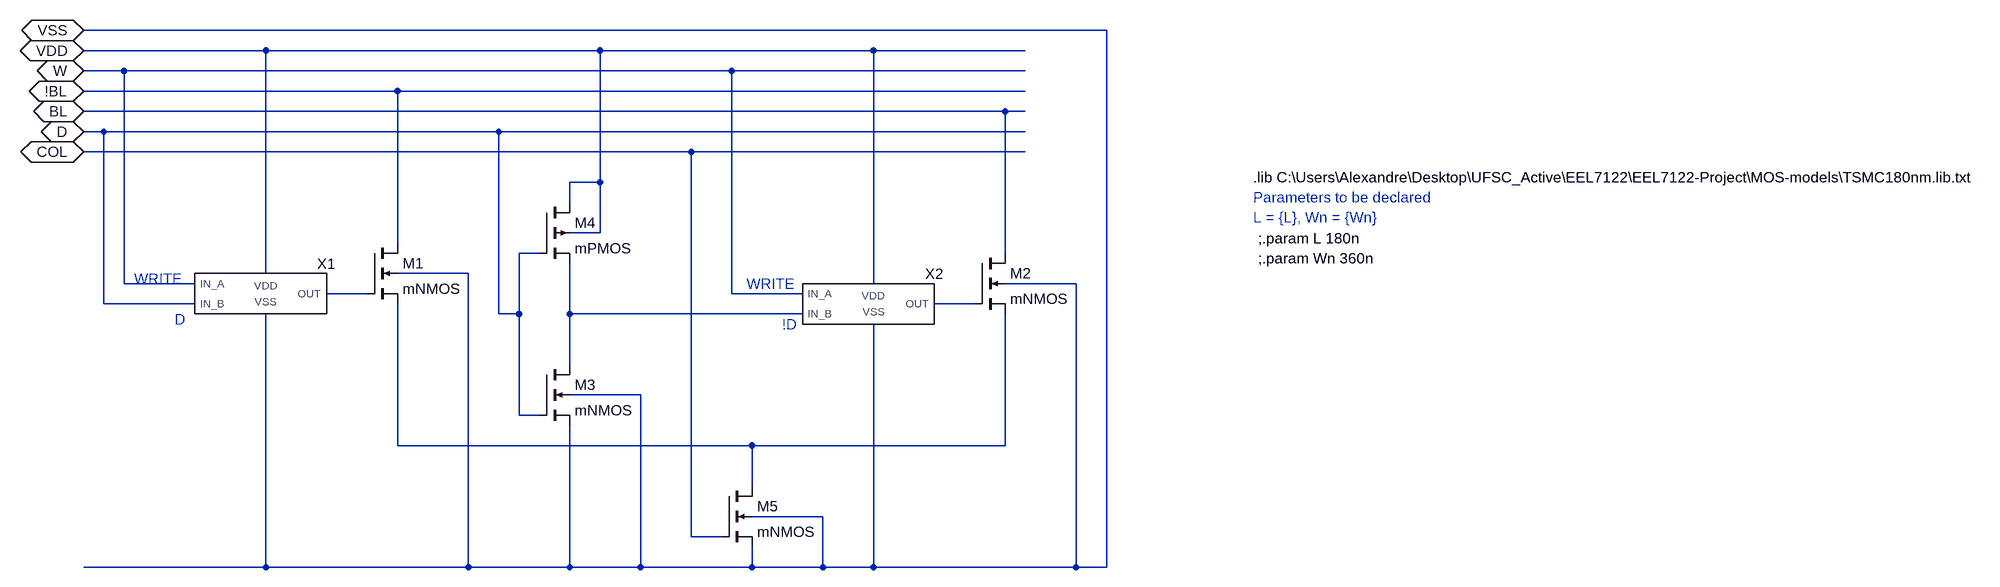
[diagram p0: schematic WRITE_DRIVER.asc]
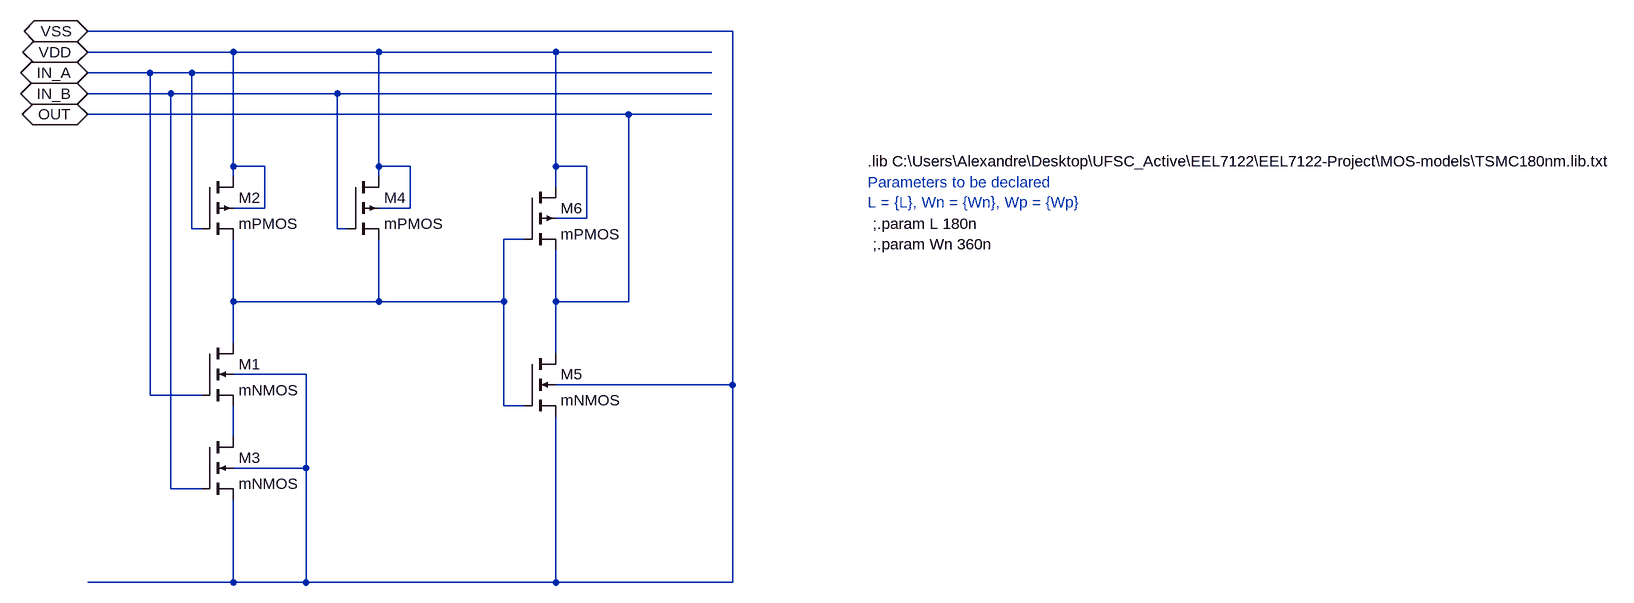
[diagram p1: sub-circuit and_sram.asc]
WRITE_DRIVER.asc, the LTspice schematic file:
Version 4
SHEET 1 2788 680
WIRE 1296 -368 -320 -368
WIRE -32 -336 -320 -336
WIRE 496 -336 -32 -336
WIRE 928 -336 496 -336
WIRE 1168 -336 928 -336
WIRE -256 -304 -320 -304
WIRE 704 -304 -256 -304
WIRE 1168 -304 704 -304
WIRE 176 -272 -320 -272
WIRE 1168 -272 176 -272
WIRE 1136 -240 -320 -240
WIRE 1168 -240 1136 -240
WIRE -288 -208 -320 -208
WIRE 336 -208 -288 -208
WIRE 1168 -208 336 -208
WIRE 640 -176 -320 -176
WIRE 1168 -176 640 -176
WIRE 496 -128 496 -336
WIRE 496 -128 448 -128
WIRE 448 -96 448 -128
WIRE 496 -48 496 -128
WIRE 496 -48 448 -48
WIRE 176 -32 176 -272
WIRE 400 -16 368 -16
WIRE 1136 -16 1136 -240
WIRE -32 16 -32 -336
WIRE 288 16 176 16
WIRE -256 32 -256 -304
WIRE -144 32 -256 32
WIRE 928 32 928 -336
WIRE 1248 32 1136 32
WIRE 128 48 64 48
WIRE 704 48 704 -304
WIRE 816 48 704 48
WIRE -288 64 -288 -208
WIRE -144 64 -288 64
WIRE 1088 64 1024 64
WIRE 336 80 336 -208
WIRE 368 80 368 -16
WIRE 368 80 336 80
WIRE 448 80 448 0
WIRE 816 80 448 80
WIRE 448 160 448 80
WIRE 560 208 448 208
WIRE 368 240 368 80
WIRE 400 240 368 240
WIRE 176 288 176 64
WIRE 736 288 176 288
WIRE 1136 288 1136 80
WIRE 1136 288 736 288
WIRE 736 352 736 288
WIRE 848 400 736 400
WIRE 640 432 640 -176
WIRE 688 432 640 432
WIRE -32 480 -32 80
WIRE -32 480 -320 480
WIRE 288 480 288 16
WIRE 288 480 -32 480
WIRE 448 480 448 256
WIRE 448 480 288 480
WIRE 560 480 560 208
WIRE 560 480 448 480
WIRE 736 480 736 448
WIRE 736 480 560 480
WIRE 848 480 848 400
WIRE 848 480 736 480
WIRE 928 480 928 96
WIRE 928 480 848 480
WIRE 1248 480 1248 32
WIRE 1248 480 928 480
WIRE 1296 480 1296 -368
WIRE 1296 480 1248 480
FLAG -320 -368 VSS
IOPIN -320 -368 BiDir
FLAG -320 -336 VDD
IOPIN -320 -336 BiDir
FLAG -320 -304 W
IOPIN -320 -304 BiDir
FLAG -320 -272 !BL
IOPIN -320 -272 BiDir
FLAG -320 -240 BL
IOPIN -320 -240 BiDir
FLAG -320 -208 D
IOPIN -320 -208 BiDir
FLAG -320 -176 COL
IOPIN -320 -176 BiDir
SYMBOL AND_SRAM -32 48 R0
SYMATTR InstName X1
SYMATTR SpiceLine L = {L}, Wn = {Wn}, Wp = {Wp}
SYMBOL AND_SRAM 928 64 R0
SYMATTR InstName X2
SYMATTR SpiceLine L = {L}, Wn = {Wn}, Wp = {Wp}
SYMBOL nmos4 128 -32 R0
SYMATTR InstName M1
SYMATTR Value mNMOS
SYMATTR Value2 l={L} w={50*Wn} ad={L*50*Wn} as={L*50*Wn} pd={2*50*Wn} ps={2*50*Wn} m=1
SYMBOL nmos4 1088 -16 R0
SYMATTR InstName M2
SYMATTR Value mNMOS
SYMATTR Value2 l={L} w={50*Wn} ad={L*50*Wn} as={L*50*Wn} pd={2*50*Wn} ps={2*50*Wn} m=1
SYMBOL nmos4 400 160 R0
SYMATTR InstName M3
SYMATTR Value mNMOS
SYMATTR Value2 l={L} w={Wn} ad={L*Wn} as={L*Wn} pd={2*Wn} ps={2*Wn} m=1
SYMBOL pmos4 400 -96 R0
SYMATTR InstName M4
SYMATTR Value mPMOS
SYMATTR Value2 l={L} w={Wp} ad={2*Wn*L} as={2*Wn*L} pd={2*2*Wn} ps={2*2*Wn} m=1
SYMBOL nmos4 688 352 R0
SYMATTR InstName M5
SYMATTR Value mNMOS
SYMATTR Value2 l={L} w={50*Wn} ad={L*50*Wn} as={L*50*Wn} pd={2*50*Wn} ps={2*50*Wn} m=1
TEXT 728 32 Left 2 ;WRITE
TEXT -240 24 Left 2 ;WRITE
TEXT 784 96 Left 2 ;!D
TEXT -176 88 Left 2 ;D
TEXT 1528 -136 Left 2 !.lib C:\\Users\\Alexandre\\Desktop\\UFSC_Active\\EEL7122\\EEL7122-Project\\MOS-models\\TSMC180nm.lib.txt
TEXT 1536 -40 Left 2 !;.param L 180n
TEXT 1536 -8 Left 2 !;.param Wn 360n
TEXT 1528 -104 Left 2 ;Parameters to be declared\nL = {L}, Wn = {Wn}

and_sram.asc, the sub-circuit schematic file:
Version 4
SHEET 1 2396 680
WIRE 928 -176 -64 -176
WIRE 160 -144 -64 -144
WIRE 384 -144 160 -144
WIRE 656 -144 384 -144
WIRE 896 -144 656 -144
WIRE 32 -112 -64 -112
WIRE 96 -112 32 -112
WIRE 896 -112 96 -112
WIRE 64 -80 -64 -80
WIRE 320 -80 64 -80
WIRE 896 -80 320 -80
WIRE 768 -48 -64 -48
WIRE 896 -48 768 -48
WIRE 160 32 160 -144
WIRE 208 32 160 32
WIRE 384 32 384 -144
WIRE 432 32 384 32
WIRE 656 32 656 -144
WIRE 704 32 656 32
WIRE 160 48 160 32
WIRE 384 48 384 32
WIRE 656 64 656 32
WIRE 208 96 208 32
WIRE 208 96 160 96
WIRE 432 96 432 32
WIRE 432 96 384 96
WIRE 704 112 704 32
WIRE 704 112 656 112
WIRE 96 128 96 -112
WIRE 112 128 96 128
WIRE 320 128 320 -80
WIRE 336 128 320 128
WIRE 608 144 576 144
WIRE 160 240 160 144
WIRE 384 240 384 144
WIRE 384 240 160 240
WIRE 576 240 576 144
WIRE 576 240 384 240
WIRE 656 240 656 160
WIRE 768 240 768 -48
WIRE 768 240 656 240
WIRE 160 304 160 240
WIRE 656 320 656 240
WIRE 272 352 160 352
WIRE 928 368 928 -176
WIRE 928 368 656 368
WIRE 32 384 32 -112
WIRE 112 384 32 384
WIRE 576 400 576 240
WIRE 608 400 576 400
WIRE 160 448 160 400
WIRE 272 496 272 352
WIRE 272 496 160 496
WIRE 64 528 64 -80
WIRE 112 528 64 528
WIRE 160 672 160 544
WIRE 160 672 -64 672
WIRE 272 672 272 496
WIRE 272 672 160 672
WIRE 656 672 656 416
WIRE 656 672 272 672
WIRE 928 672 928 368
WIRE 928 672 656 672
FLAG -64 -48 OUT
IOPIN -64 -48 BiDir
FLAG -64 -144 VDD
IOPIN -64 -144 BiDir
FLAG -64 -176 VSS
IOPIN -64 -176 BiDir
FLAG -64 -112 IN_A
IOPIN -64 -112 BiDir
FLAG -64 -80 IN_B
IOPIN -64 -80 BiDir
SYMBOL nmos4 112 304 R0
SYMATTR InstName M1
SYMATTR Value mNMOS
SYMATTR Value2 l={L} w={2*Wn} ad={2*L*Wn} as={2*L*Wn} pd={2*2*Wn} ps={2*2*Wn} m=1
SYMBOL pmos4 112 48 R0
SYMATTR InstName M2
SYMATTR Value mPMOS
SYMATTR Value2 l={L} w={Wp} ad={2*Wn*L} as={2*Wn*L} pd={2*2*Wn} ps={2*2*Wn} m=1
SYMBOL nmos4 112 448 R0
SYMATTR InstName M3
SYMATTR Value mNMOS
SYMATTR Value2 l={L} w={2*Wn} ad={2*L*Wn} as={2*L*Wn} pd={2*2*Wn} ps={2*2*Wn} m=1
SYMBOL pmos4 336 48 R0
SYMATTR InstName M4
SYMATTR Value mPMOS
SYMATTR Value2 l={L} w={Wp} ad={2*Wn*L} as={2*Wn*L} pd={2*2*Wn} ps={2*2*Wn} m=1
SYMBOL nmos4 608 320 R0
SYMATTR InstName M5
SYMATTR Value mNMOS
SYMATTR Value2 l={L} w={Wn} ad={L*Wn} as={L*Wn} pd={2*Wn} ps={2*Wn} m=1
SYMBOL pmos4 608 64 R0
SYMATTR InstName M6
SYMATTR Value mPMOS
SYMATTR Value2 l={L} w={Wp} ad={2*Wn*L} as={2*Wn*L} pd={2*2*Wn} ps={2*2*Wn} m=1
TEXT 1136 24 Left 2 !.lib C:\\Users\\Alexandre\\Desktop\\UFSC_Active\\EEL7122\\EEL7122-Project\\MOS-models\\TSMC180nm.lib.txt
TEXT 1144 120 Left 2 !;.param L 180n
TEXT 1144 152 Left 2 !;.param Wn 360n
TEXT 1136 56 Left 2 ;Parameters to be declared\nL = {L}, Wn = {Wn}, Wp = {Wp}

The netlist it stands for:
* WRITE_DRIVER.asc
XX1 W D N001 VDD VSS and_sram params: L = {L}, Wn = {Wn}, Wp = {Wp}
XX2 W N003 N002 VDD VSS and_sram params: L = {L}, Wn = {Wn}, Wp = {Wp}
M1 !BL N001 N004 VSS mNMOS l={L} w={50*Wn} ad={L*50*Wn} as={L*50*Wn} pd={2*50*Wn} ps={2*50*Wn} m=1
M2 BL N002 N004 VSS mNMOS l={L} w={50*Wn} ad={L*50*Wn} as={L*50*Wn} pd={2*50*Wn} ps={2*50*Wn} m=1
M3 N003 D VSS VSS mNMOS l={L} w={Wn} ad={L*Wn} as={L*Wn} pd={2*Wn} ps={2*Wn} m=1
M4 VDD D N003 VDD mPMOS l={L} w={Wp} ad={2*Wn*L} as={2*Wn*L} pd={2*2*Wn} ps={2*2*Wn} m=1
M5 N004 COL VSS VSS mNMOS l={L} w={50*Wn} ad={L*50*Wn} as={L*50*Wn} pd={2*50*Wn} ps={2*50*Wn} m=1

* block symbol definitions
.subckt and_sram IN_A IN_B OUT VDD VSS
M1 N001 IN_A N002 VSS mNMOS l={L} w={2*Wn} ad={2*L*Wn} as={2*L*Wn} pd={2*2*Wn} ps={2*2*Wn} m=1
M2 VDD IN_A N001 VDD mPMOS l={L} w={Wp} ad={2*Wn*L} as={2*Wn*L} pd={2*2*Wn} ps={2*2*Wn} m=1
M3 N002 IN_B VSS VSS mNMOS l={L} w={2*Wn} ad={2*L*Wn} as={2*L*Wn} pd={2*2*Wn} ps={2*2*Wn} m=1
M4 VDD IN_B N001 VDD mPMOS l={L} w={Wp} ad={2*Wn*L} as={2*Wn*L} pd={2*2*Wn} ps={2*2*Wn} m=1
M5 OUT N001 VSS VSS mNMOS l={L} w={Wn} ad={L*Wn} as={L*Wn} pd={2*Wn} ps={2*Wn} m=1
M6 VDD N001 OUT VDD mPMOS l={L} w={Wp} ad={2*Wn*L} as={2*Wn*L} pd={2*2*Wn} ps={2*2*Wn} m=1
.lib C:\Users\Alexandre\Desktop\UFSC_Active\EEL7122\EEL7122-Project\MOS-models\TSMC180nm.lib.txt
;.param L 180n
;.param Wn 360n
* Parameters to be declared
* L = {L}, Wn = {Wn}, Wp = {Wp}
.ends and_sram

.model NMOS NMOS
.model PMOS PMOS
.lib standard.mos
* WRITE
* WRITE
* !D
* D
.lib C:\Users\Alexandre\Desktop\UFSC_Active\EEL7122\EEL7122-Project\MOS-models\TSMC180nm.lib.txt
;.param L 180n
;.param Wn 360n
* Parameters to be declared
* L = {L}, Wn = {Wn}
.backanno
.end